# Altium schematic sheet Temp Bank.SchDoc
size A3; SheetNumber: 5; SheetTotal: 5
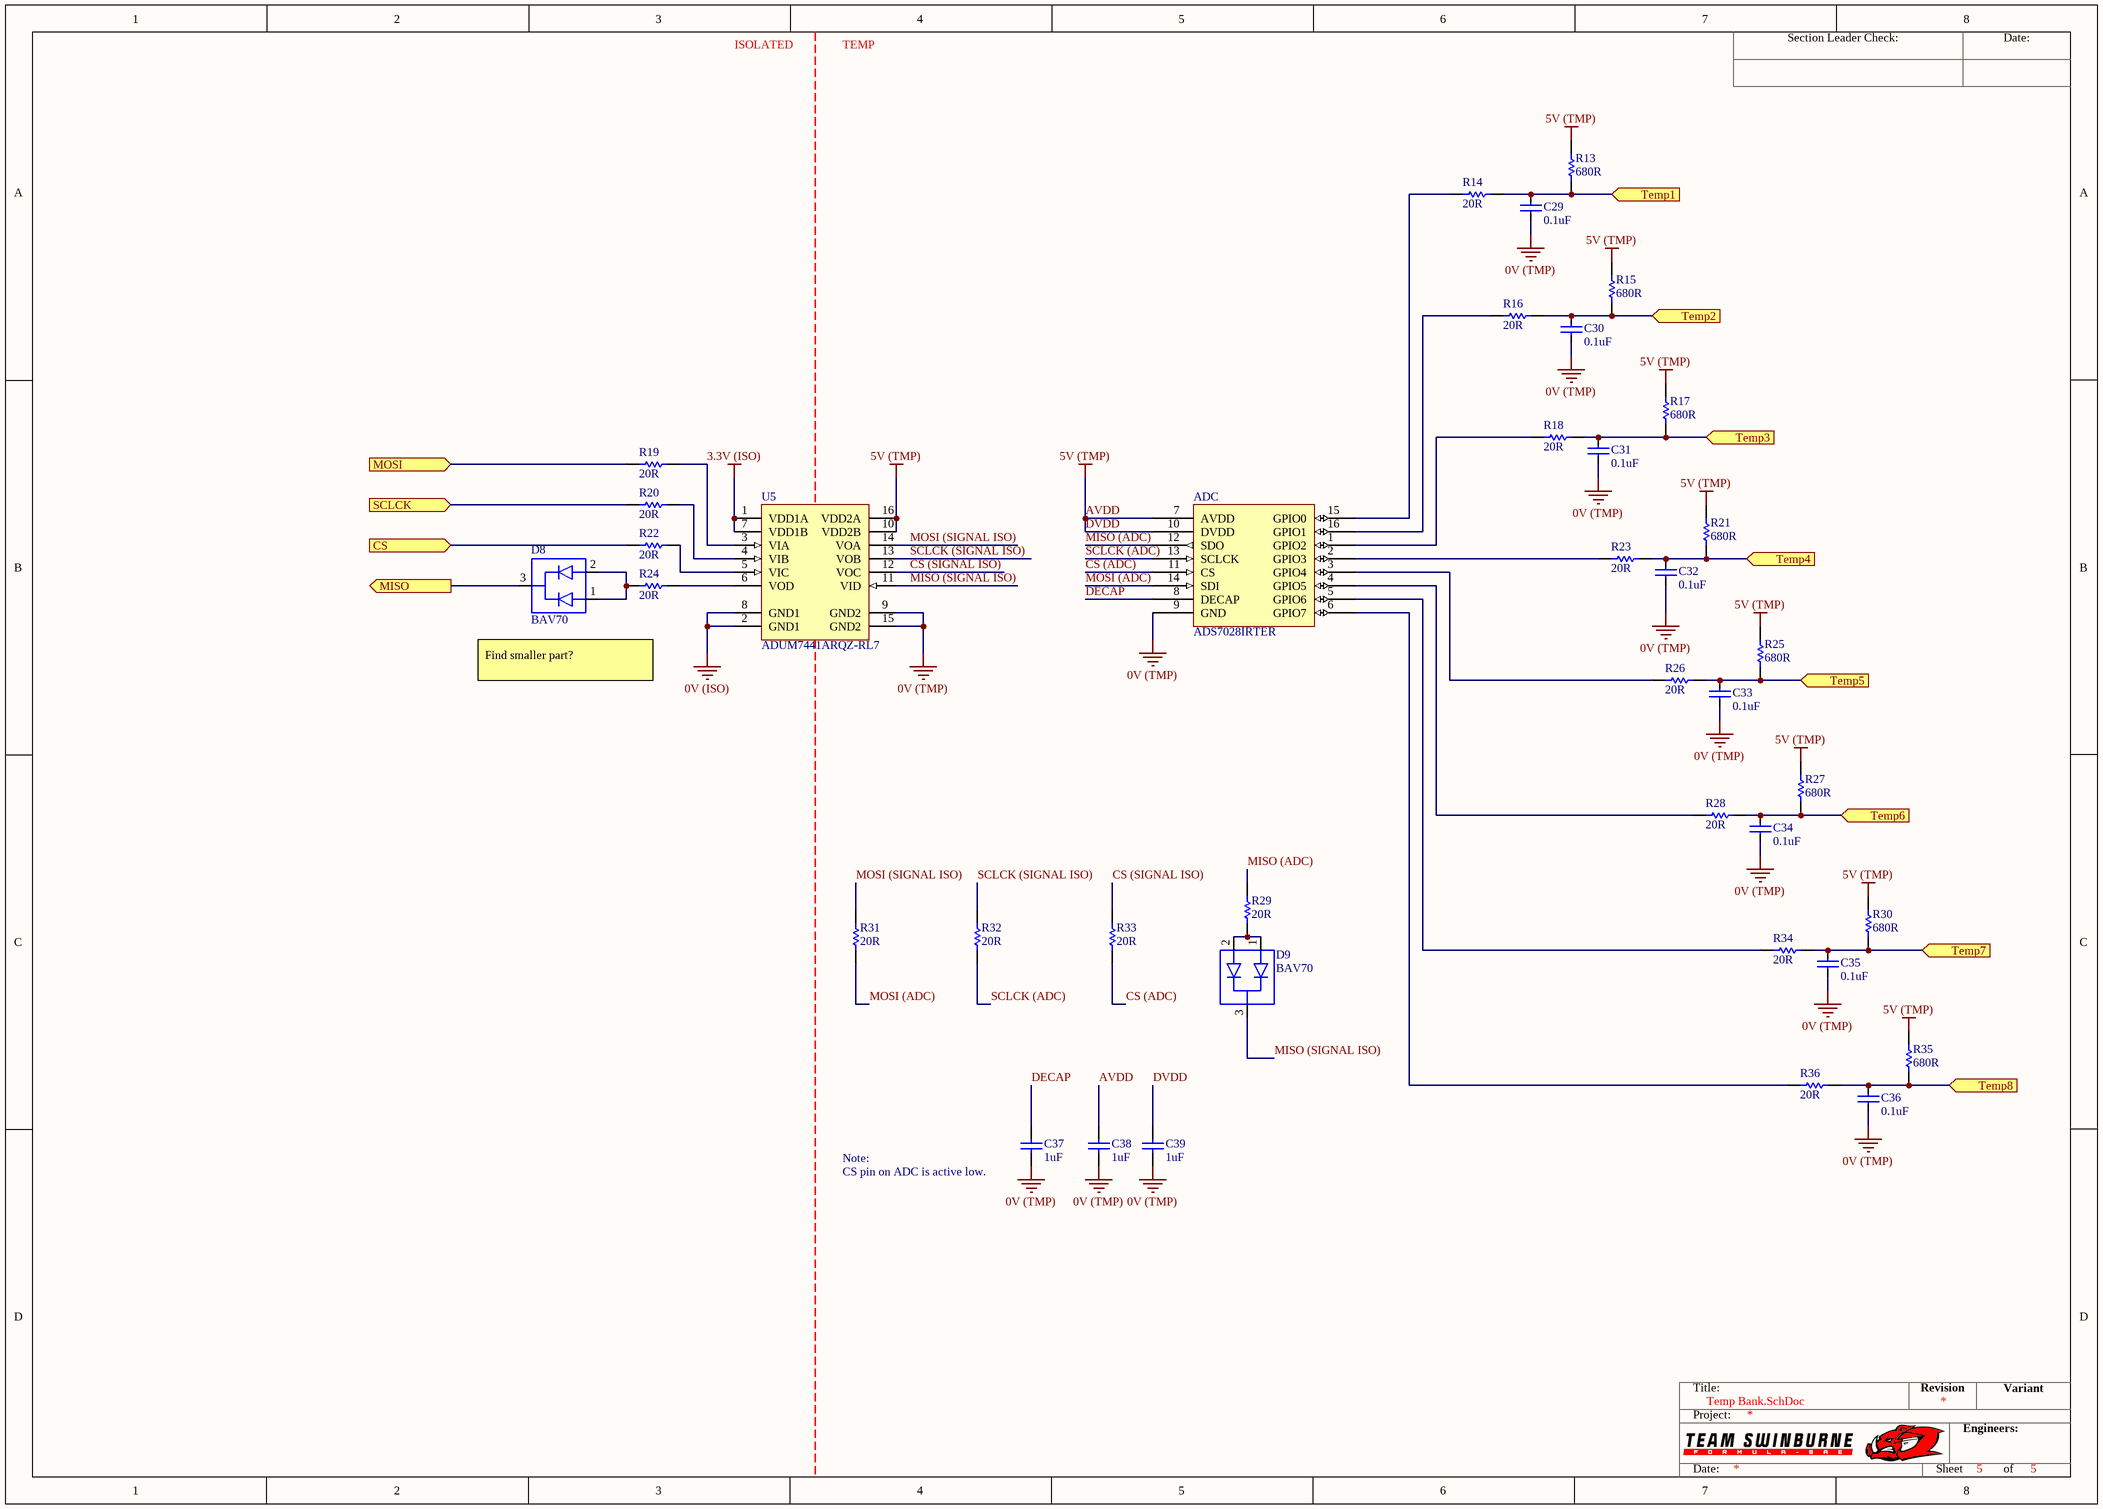
[diagram p0: Temp Bank.SchDoc]

## Parts
ADC  ADS7028IRTER  [QFN50P300X300X80_HS-17N]
C29  0.1uF  [0805]
C30  0.1uF  [0805]
C31  0.1uF  [0805]
C32  0.1uF  [0805]
C33  0.1uF  [0805]
C34  0.1uF  [0805]
C35  0.1uF  [0805]
C36  0.1uF  [0805]
C37  1uF  [0805]
C38  1uF  [0805]
C39  1uF  [0805]
D8  BAV70  [BAV70-Footprint-1]
D9  BAV70  [BAV70-Footprint-1]
R13  680R  [0805]
R14  20R  [RESC0603]
R15  680R  [0805]
R16  20R  [RESC0603]
R17  680R  [0805]
R18  20R  [RESC0603]
R19  20R  [RESC0603]
R20  20R  [RESC0603]
R21  680R  [0805]
R22  20R  [RESC0603]
R23  20R  [RESC0603]
R24  20R  [RESC0603]
R25  680R  [0805]
R26  20R  [RESC0603]
R27  680R  [0805]
R28  20R  [RESC0603]
R29  20R  [RESC0603]
R30  680R  [0805]
R31  20R  [RESC0603]
R32  20R  [RESC0603]
R33  20R  [RESC0603]
R34  20R  [RESC0603]
R35  680R  [0805]
R36  20R  [RESC0603]
U5  ADUM7441ARQZ-RL7  [ADI-RQ-16_M]

## Ports
CS (in), MISO (out), MOSI (in), SCLCK (in), Temp1 (in), Temp2 (in), Temp3 (in), Temp4 (in), Temp5 (in), Temp6 (in), Temp7 (in), Temp8 (in)

## Nets
0V (ISO): U5.2(GND1) U5.8(GND1)
0V (TMP): ADC.9(GND) C29.2 C30.2 C31.2 C32.2 C33.2 C34.2 C35.2 C36.2 C37.1 C38.1 C39.1 U5.9(GND2) U5.15(GND2)
3.3V (ISO): U5.1(VDD1A) U5.7(VDD1B)
AVDD: ADC.7(AVDD) ADC.10(DVDD) C38.2 C39.2 R13.2 R15.2 R17.2 R21.2 R25.2 R27.2 R30.2 R35.2 U5.10(VDD2B) U5.16(VDD2A)  [also labelled 5V (TMP), DVDD]
CS: R22.1 ; port CS
CS (ADC): ADC.11(CS) R33.1
CS (SIGNAL ISO): R33.2 U5.12(VOC)
DECAP: ADC.8(DECAP) C37.2
MISO: D8.3(CC) ; port MISO
MISO (ADC): ADC.12(SDO) R29.2
MISO (SIGNAL ISO): D9.3(CC) U5.11(VID)
MOSI: R19.1 ; port MOSI
MOSI (ADC): ADC.14(SDI) R31.1
MOSI (SIGNAL ISO): R31.2 U5.14(VOA)
SCLCK: R20.1 ; port SCLCK
SCLCK (ADC): ADC.13(SCLCK) R32.1
SCLCK (SIGNAL ISO): R32.2 U5.13(VOB)
Temp1: C29.1 R13.1 R14.2 ; port Temp1
Temp2: C30.1 R15.1 R16.2 ; port Temp2
Temp3: C31.1 R17.1 R18.2 ; port Temp3
Temp4: C32.1 R21.1 R23.2 ; port Temp4
Temp5: C33.1 R25.1 R26.2 ; port Temp5
Temp6: C34.1 R27.1 R28.2 ; port Temp6
Temp7: C35.1 R30.1 R34.2 ; port Temp7
Temp8: C36.1 R35.1 R36.2 ; port Temp8
NetADC_1: ADC.1(GPIO2) R18.1
NetADC_2: ADC.2(GPIO3) R23.1
NetADC_3: ADC.3(GPIO4) R26.1
NetADC_4: ADC.4(GPIO5) R28.1
NetADC_5: ADC.5(GPIO6) R34.1
NetADC_6: ADC.6(GPIO7) R36.1
NetADC_15: ADC.15(GPIO0) R14.1
NetADC_16: ADC.16(GPIO1) R16.1
NetD8_1: D8.1(A1) D8.2(A2) R24.1
NetD9_1: D9.1(A1) D9.2(A2) R29.1
NetR19_2: R19.2 U5.3(VIA)
NetR20_2: R20.2 U5.4(VIB)
NetR22_2: R22.2 U5.5(VIC)
NetR24_2: R24.2 U5.6(VOD)

## Notes on the sheet
- ISOLATED
- TEMP
- Find smaller part?
- Note:
- (near C37) CS pin on ADC is active low.
- Section Leader Check:
- Date:
- Title:
- Revision
- Variant
- Project:
- Engineers:
- Sheet
- of

## Library data of the parts
ADC = CMP-001-0002-13: Small 8-channel 12-bit analog-to-digital converter (ADC) with SPI, GPIOs and CRC 16-WQFN -40 to 85
C29-C36 = CMP-00018-1: Cap Ceramic 0.1uF 25V X7R 10% Pad SMD 0805 125C Automotive T/R; Capacitance: 100nF; Max Operating Temperature: 125°C; RoHS Compliant: Yes; Series: GCM; Case Code (Metric): 2012; Thickness: 0.055inch; Depth: 1.25mm; Width: 1.25mm; Package Quantity: 3000; Case Code (Imperial): 0805; Voltage Rating (DC): 25V; Dielectric: X7R; Construction: Flat; Height: 1.25mm; Ratings: AEC-Q200; Mount: Surface Mount; Voltage Rating: 25V; Tolerance: 10%; Length: 2mm; Case/Package: 0805; Packaging: Tape and Reel; Min Operating Temperature: -55°C; Radiation Hardening: No; Termination: SMD/SMT
C37-C39 = AC0805KKX7R8BB105: Manufacturer: YAGEO; Tolerance: 10%; Material: X7R; Rated Voltage: 25V; Part Number: AC0805KKX7R8BB105; Value: 1uF; Digikey Part Number: DO NOT USE FOR NEW DESIGNS
D8 D9 = CMP-004-00001-1: DIODE ARRAY GP 70V 200mA SOT23-3; RoHS Compliant: No
R13 R15 R17 R21 R25 R27 R30 R35 = CMP-037-000298-3: RC0805FR07680RL; Rated Voltage: 0.125W; Tolerance: 0.01; Material: FR-07; Digikey Part Number: 311-680CRCT-ND; Value: 680R
R14 R16 R18-R20 R22-R24 R26 R28 R29 R31-R34 R36 = CMP-RES-0043-1: RES SMD 20 OHM JUMPER 1/10W 0603; Voltage Rating: 50V; Tolerance: 1%; Power Rating: 100mW; Case/Package: 0603; Min Operating Temperature: -55°C; Max Operating Temperature: 155°C
U5 = CMP-001-0005-5: Digital Isolator CMOS 4-CH 1Mbps 16-Pin QSOP T/R; Pulse Width Distortion (PWD): 25ns; Nominal Supply Current: 4.1mA; Data Rate: 25Mbps; Turn-On Delay Time: 56ns; Max Supply Voltage: 5.5V; Isolated Power: No; Min Supply Voltage: 3V; Propagation Delay: 75ns; Channel Type: Unidirectional; Number of Channels: 4; Lead Free: Contains Lead; Number of Pins: 16; Contact Plating: Tin,Matte; RoHS Compliant: Yes; Package Quantity: 1000; Type: General Purpose; Supply Current: 4.1mA; Case/Package: QSOP; Max Operating Temperature: 105°C; Packaging: Tape and Reel; Series: iCoupler®; Min Operating Temperature: -40°C